# EAGLE schematic ITALY_DOZATOR_el (EAGLE 7.0.0)
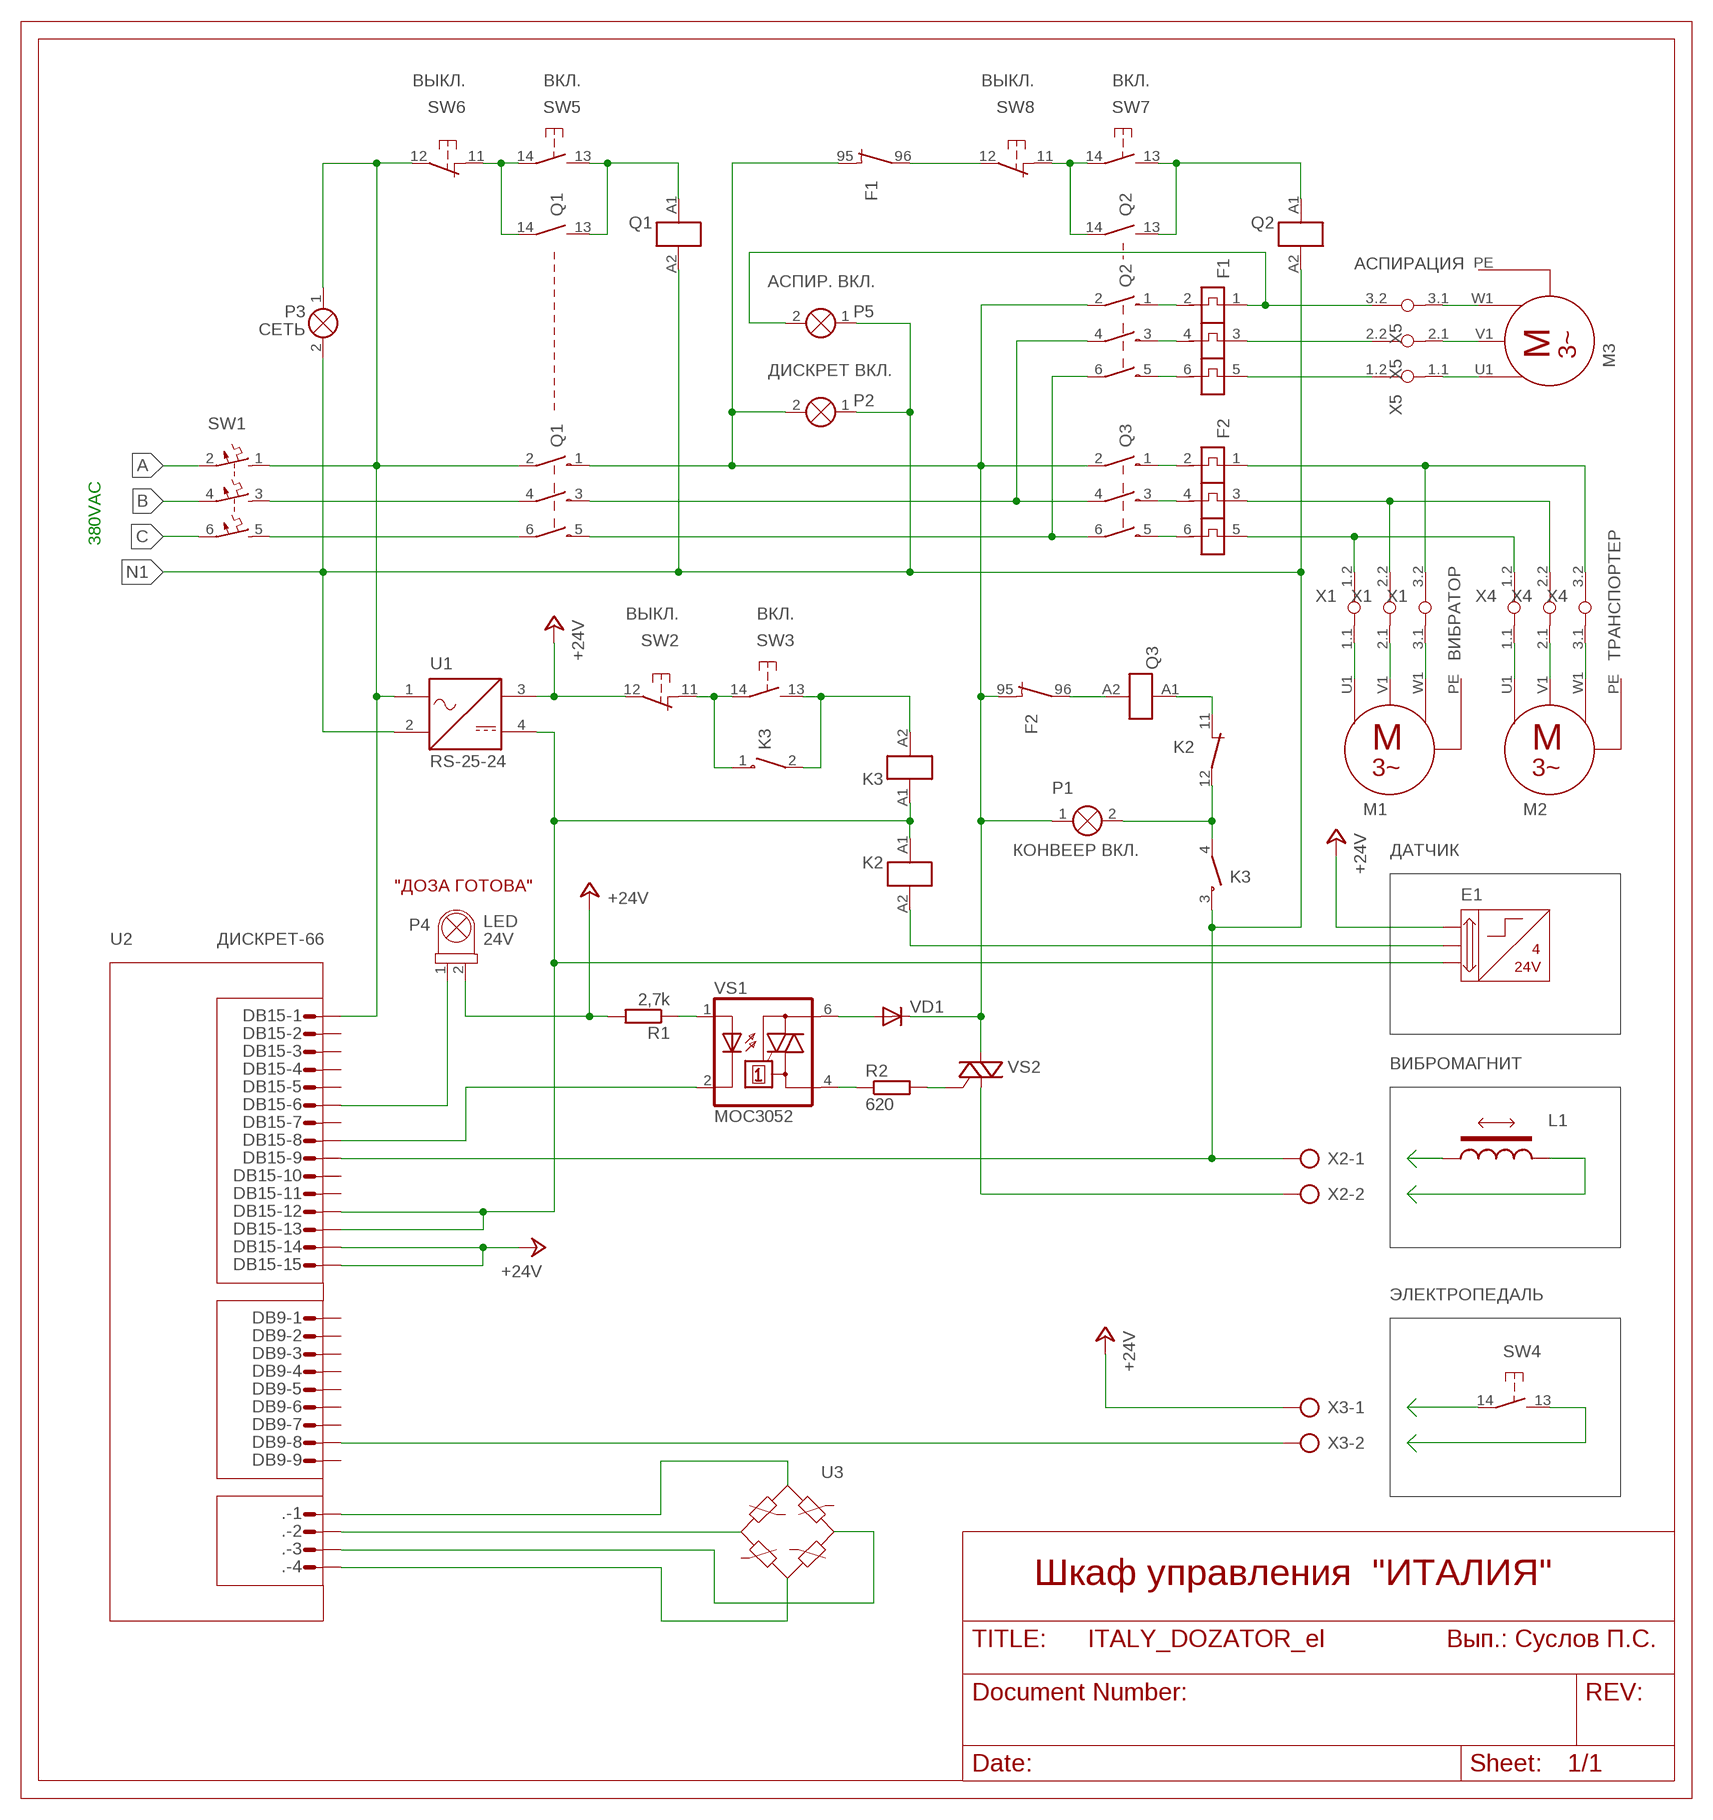
[diagram p0: schematic, sheet 1]

## Parts
.  L04P  [L04P]
DB9  L09P  [L09P]
DB15  L15P  [L15P]
E1  6158EB  [6158EB]
F1  MOTORSCHUTZSCHALTER_3-POL_THERM_AUSLOESUNG_HILFSKONTAKTE  [MOTORSCHUTZSCHALTER_3-POL_THERM_AUSLOESUNG_HILFSKONTAKT_95_96_97_98]
F2  MOTORSCHUTZSCHALTER_3-POL_THERM_AUSLOESUNG_HILFSKONTAKTE  [MOTORSCHUTZSCHALTER_3-POL_THERM_AUSLOESUNG_HILFSKONTAKT_95_96_97_98]
K2  HILFSSCHUETZ_11-12  [HILFSSCHUETZ_11-12]
K3  HAUPTSCHUETZ_2-POL  [HAUPTSCHUETZ_2-POL]
L1  L-US0204/5  [0204/5]
M1  MOTOR_3-POL_PE  [MOTOR_3-POL_PE]
M2  MOTOR_3-POL_PE  [MOTOR_3-POL_PE]
M3  MOTOR_3-POL_PE  [MOTOR_3-POL_PE]
P1  КОНВЕЕР ВКЛ.  SIGNALLAMPE  [LAMPE]
P2  ДИСКРЕТ ВКЛ.  SIGNALLAMPE  [LAMPE]
P3  СЕТЬ  SIGNALLAMPE  [LAMPE]
P4  BLINK/BLITZLEUCHTE  [LAMPE]
P5  АСПИР. ВКЛ.  SIGNALLAMPE  [LAMPE]
Q1  HAUPTSCHUETZ_3-POL_HILFSKONTAKT_13-14  [HAUPTSCHUETZ_3-POL+HILFSKONTAKT_13-14]
Q2  HAUPTSCHUETZ_3-POL_HILFSKONTAKT_13-14  [HAUPTSCHUETZ_3-POL+HILFSKONTAKT_13-14]
Q3  HAUPTSCHUETZ_3-POL  [HAUPTSCHUETZ_3-POL]
R1  2,7k  R-EU_0204/2V  [0204V]
R2  620  R-EU_0204/2V  [0204V]
SW1  LEITUNGSSCHUTZSCHALTER_3-POL  [LEITUNGSSCHUTZSCHALTER_3-POL]
SW2  ВЫКЛ.  OEFFNER_TASTSCHALTER  [OEFFNER_TASTSCHALTER]
SW3  ВКЛ.  SCHLIESSER_TASTSCHALTER  [SCHLIESSER_TASTSCHALTER]
SW4  SCHLIESSER_TASTSCHALTER  [SCHLIESSER_TASTSCHALTER]
SW5  ВКЛ.  SCHLIESSER_TASTSCHALTER  [SCHLIESSER_TASTSCHALTER]
SW6  ВЫКЛ.  OEFFNER_TASTSCHALTER  [OEFFNER_TASTSCHALTER]
SW7  ВКЛ.  SCHLIESSER_TASTSCHALTER  [SCHLIESSER_TASTSCHALTER]
SW8  ВЫКЛ.  OEFFNER_TASTSCHALTER  [OEFFNER_TASTSCHALTER]
U1  RS-25-24  NETZTEIL_GLEICHSPANNUNG  [NETZTEIL_GLEICHSPANNUNG]
VD1  1N4148DO35-7  [DO35-7]
VS1  MOC3052  MOC3042T  [DIL06B]
VS2  TRIAC  [TRIAC]
X1  KLEMME_1-3  [KLEMME_1-3]
X2  AK500/2  [AK500/2]
X3  AK500/2  [AK500/2]
X4  KLEMME_1-3  [KLEMME_1-3]
X5  KLEMME_1-3  [KLEMME_1-3]

## Nets
+24V: DB15.14 DB15.15 P4.2(X2) R1.2 SW2.12 U1.3 X3.1
A: SW1.2
B: SW1.4
C: SW1.6
N1: DB15.9 K3.3 P2.1(X1) P3.2(X2) P5.1(X1) Q1.A2(1:A2) Q2.A2(1:A2) U1.2 X2.1
N$1: DB15.12 DB15.13 K2.A1 K3.A1(1:A1) U1.4
N$2: VS2.A2 X2.2
N$3: R2.1 VS1.4(A1)
N$4: E1.1 K2.A2
N$5: K3.2 K3.A2(1:A2) SW3.13
N$6: K3.1 SW2.11 SW3.14
N$7: Q1.13 Q1.A1(1:A1) SW5.13
N$8: R2.2 VS2.G
N$9: VD1.A VS1.6(A2)
N$10: Q1.14 SW5.14 SW6.11
N$11: R1.1 VS1.1(A)
N$12: DB15.8 VS1.2(C)
N$13: DB9.8 X3.2
N$14: Q2.13 Q2.A1(1:A1) SW7.13
N$15: Q2.14 SW7.14 SW8.11
N$16: ..1
N$17: ..2
N$18: ..3
N$19: ..4
N$20: L1.1
N$21: L1.2
N$22: SW4.14
N$23: SW4.13
N$24: Q1.5 Q2.6 Q3.6
N$25: M3.U1 X5.1.1(1:1.1)
N$26: F2.5 X1.1.2(1:1.2) X4.1.2(1:1.2)
N$27: F2.3 X1.2.2(2:2.2) X4.2.2(2:2.2)
N$28: F2.1 X1.3.2(3:3.2) X4.3.2(3:3.2)
N$29: K2.11 Q3.A1
N$30: K2.12 K3.4 P1.2(X2)
N$31: M3.V1 X5.2.1(2:2.1)
N$32: Q1.6 SW1.5
N$33: Q1.4 SW1.3
N$34: M3.W1 X5.3.1(3:3.1)
N$35: DB15.1 P3.1(X1) Q1.2 SW1.1 SW6.12 U1.1
N$36: M1.U1 X1.1.1(1:1.1)
N$37: M1.V1 X1.2.1(2:2.1)
N$38: M1.W1 X1.3.1(3:3.1)
N$39: M2.U1 X4.1.1(1:1.1)
N$40: M2.V1 X4.2.1(2:2.1)
N$41: M2.W1 X4.3.1(3:3.1)
N$42: F1.5 X5.1.2(1:1.2)
N$43: F1.3 X5.2.2(2:2.2)
N$44: F1.1 P5.2(X2) X5.3.2(3:3.2)
N$45: F1.2 Q2.1
N$46: F1.4 Q2.3
N$47: F1.6 Q2.5
N$48: F2.2 Q3.1
N$49: F2.4 Q3.3
N$50: F2.6 Q3.5
N$51: F1.96 SW8.12
N$52: F2.96 Q3.A2
N$53: DB15.6 P4.1(X1)
OUT_B: Q1.3 Q2.4 Q3.4
OUT_C: F1.95 F2.95 P1.1(X1) P2.2(X2) Q1.1 Q2.2 Q3.2 VD1.C VS2.A1
Unconnected: DB9.1 DB9.2 DB9.3 DB9.4 DB9.5 DB9.6 DB9.7 DB9.9 DB15.2 DB15.3 DB15.4 DB15.5 DB15.7 DB15.10 DB15.11 F1.97 F1.98 F2.97 F2.98 M1.PE M2.PE M3.PE

## Notes on the sheet
- АСПИРАЦИЯ
- 380VAC
- ВИБРАТОР | ТРАНСПОРТЕР
- ДАТЧИК
- "ДОЗА ГОТОВА"
- LED
- U2 | ДИСКРЕТ-66 | 24V
- ВИБРОМАГНИТ
- ЭЛЕКТРОПЕДАЛЬ
- U3
- Шкаф управления | "ИТАЛИЯ"
- Вып.: Суслов П.С.

## Library data of the parts
. = con-amp-mt:L04P: AMP MT CONNECTOR; OC_FARNELL: unknown; OC_NEWARK: unknown
DB9 = con-amp-mt:L09P: AMP MT CONNECTOR; OC_FARNELL: unknown; OC_NEWARK: unknown
DB15 = con-amp-mt:L15P: AMP MT CONNECTOR; OC_FARNELL: unknown; OC_NEWARK: unknown
E1 = eib-busch-jaeger:6158EB: Binäreingang 4-fach Source: http://www.busch-jaeger-katalog.de http://www.busch-jaeger.de/de/elektroplaner/cad-symbole.htm
F1 F2 = e-motorschutzschalter:MOTORSCHUTZSCHALTER_3-POL_THERM_AUSLOESUNG_HILFSKONTAKTE: Motorschutzschalter 3-pol. mit thermischer Auslösung, Hilfskontakte
K2 = e-schuetze-relais:HILFSSCHUETZ_11-12: Hilfsschütz mit 1 Öffner
K3 = e-schuetze-relais:HAUPTSCHUETZ_2-POL: Hauptschütz mit 2 Schließern
L1 = rcl:L-US: INDUCTOR, American symbol
M1-M3 = e-motoren:MOTOR_3-POL_PE: 3-Phasen-Motor mit PE
P1-P3 P5 = e-lampen-signalisation:SIGNALLAMPE: Lampe
P4 = e-lampen-signalisation:BLINK/BLITZLEUCHTE: Blink-, Blitzleuchte
Q1 Q2 = e-schuetze-relais:HAUPTSCHUETZ_3-POL_HILFSKONTAKT_13-14: Hauptschütz 3-pol. mit Hilfskontakt-Schließer
Q3 = e-schuetze-relais:HAUPTSCHUETZ_3-POL: Hauptschütz mit 3 Schließern
R1 R2 = rcl:R-EU_: RESISTOR, European symbol
SW1 = e-sicherungen:LEITUNGSSCHUTZSCHALTER_3-POL: Leitungsschutzschalter, 3-pol.
SW2 SW6 SW8 = e-schalter:OEFFNER_TASTSCHALTER: Tastschalter, Öffner
SW3-SW5 SW7 = e-schalter:SCHLIESSER_TASTSCHALTER: Tastschalter, Schließer
U1 = e-stromversorgungselemente:NETZTEIL_GLEICHSPANNUNG: Netzteil, Gleichspannung
VD1 = diode:1N4148: DIODE high speed (Philips)
VS1 = optocoupler:MOC30*: 6-Pin DIP Zero-Cross Optoisolators Triac Driver Output (250/400 Volt Peak) Source: Data sheet <http://www.fairchildsemi.com/ds/MO/MOC3031M.pdf> The old path of data sheet not more available 2013-05-06.; OC_FARNELL: unknown; OC_NEWARK: unknown
VS2 = e-halbleiter:TRIAC: Triac
X1 X4 X5 = e-klemmen:KLEMME_1-3: Klemme 3 Pol.
X2 X3 = con-ptr500:AK500/2: CONNECTOR; OC_FARNELL: unknown; OC_NEWARK: unknown